# EAGLE design LM502 Break Out Board v1.0 (EAGLE 7.5.0)
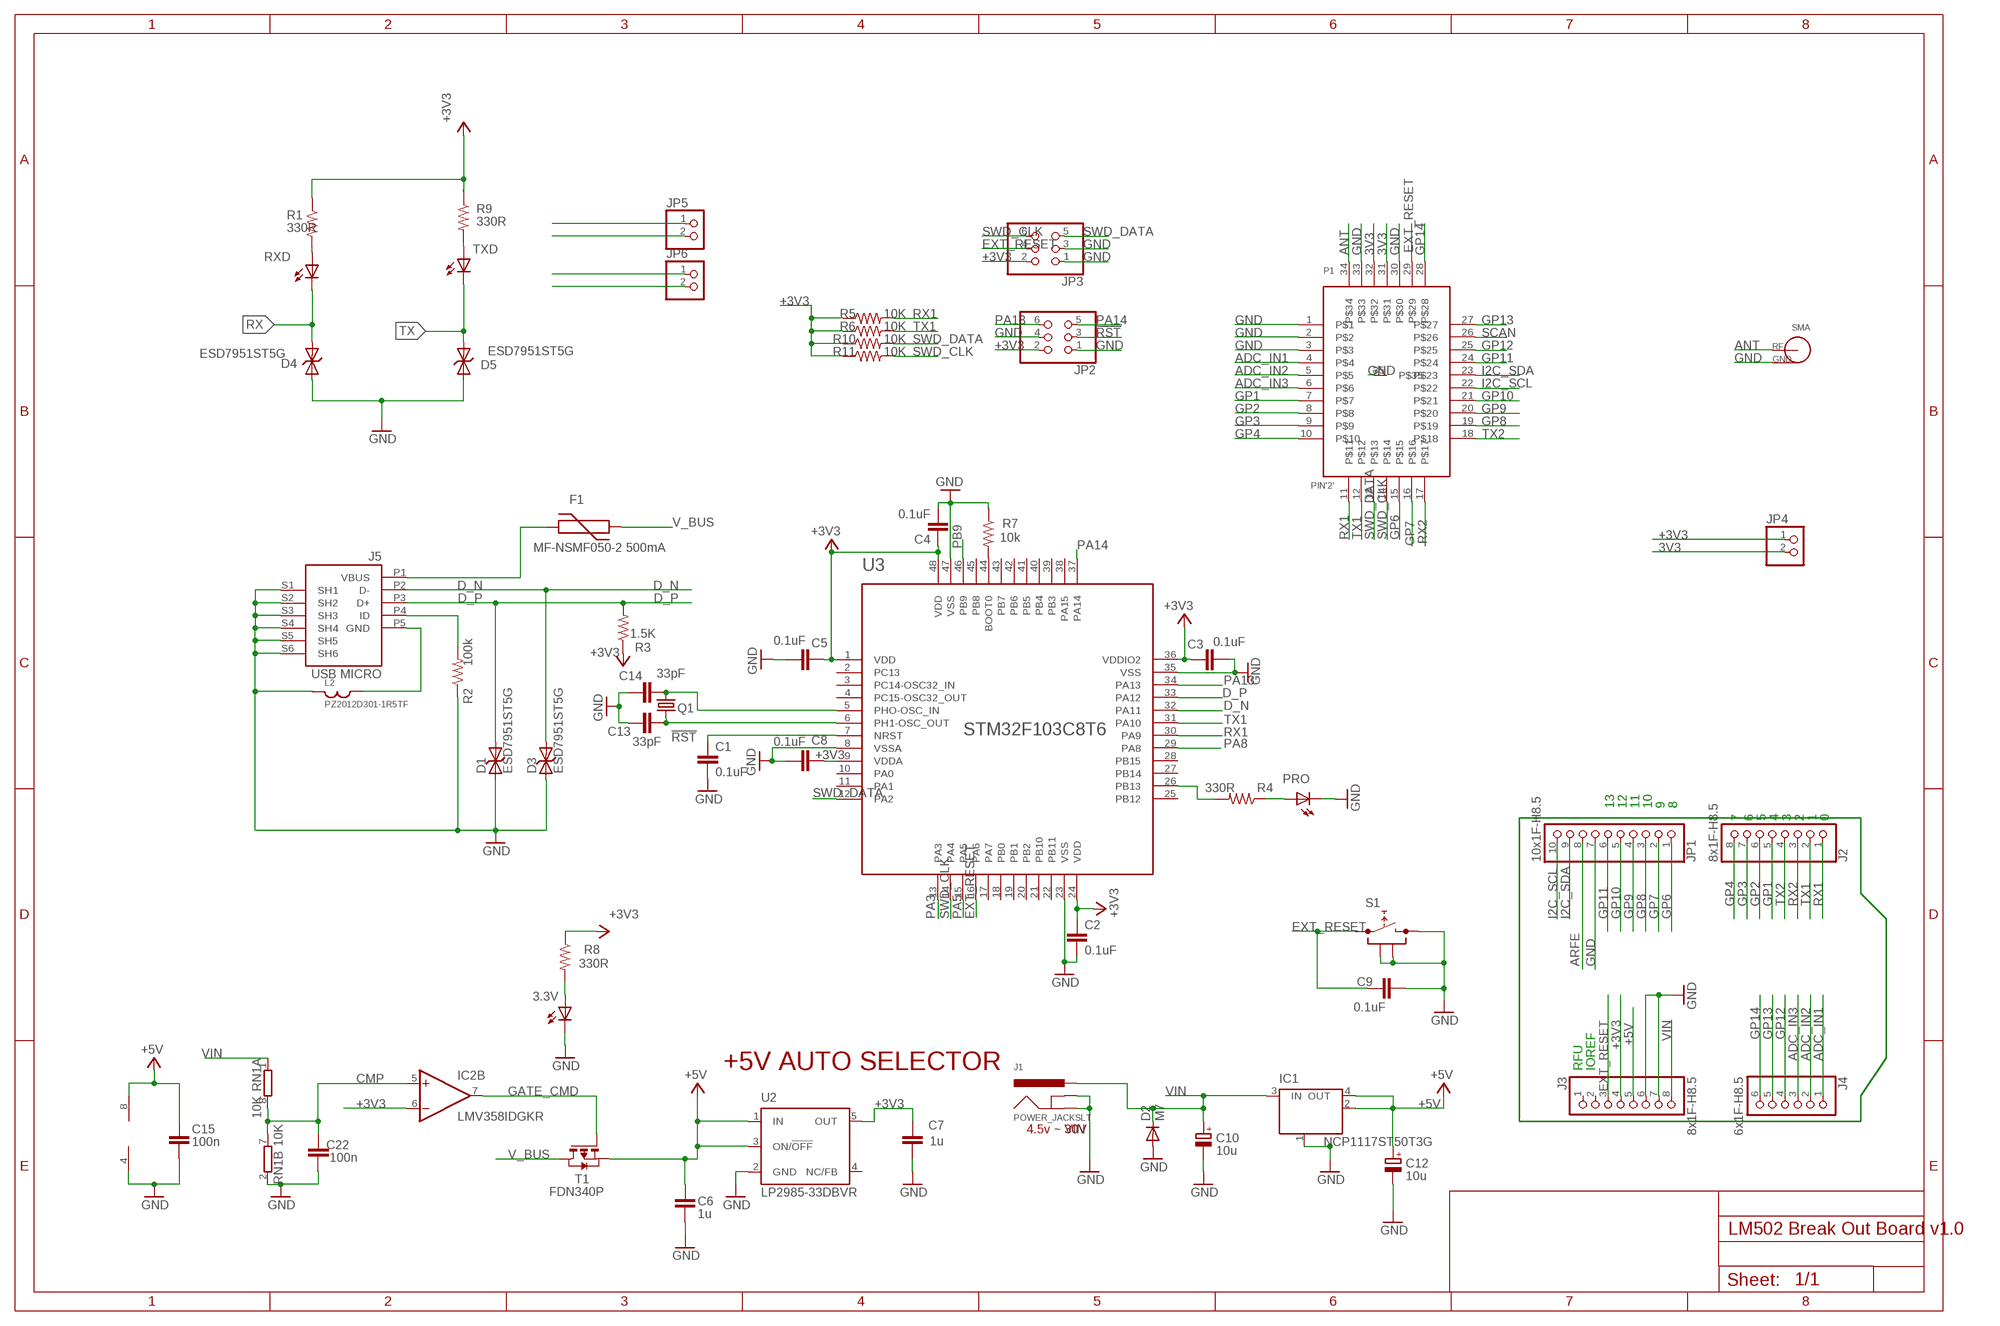
[diagram p0: schematic, sheet 1]

## Parts
3.3V  LEDCHIP-LED0603  [CHIP-LED0603]
C1  0.1uF  C-EUC0402  [C0402]
C2  0.1uF  C-EUC0402  [C0402]
C3  0.1uF  C-EUC0402  [C0402]
C4  0.1uF  C-EUC0402  [C0402]
C5  0.1uF  C-EUC0402  [C0402]
C6  1u  C-EUC0603  [C0603-ROUND]
C7  1u  C-EUC0603  [C0603-ROUND]
C8  0.1uF  C-EUC0402  [C0402]
C9  0.1uF  C-EUC0402  [C0402]
C10  10u  CPOL-EUSMCB  [SMC_B]
C12  10u  CPOL-EUSMCB  [SMC_B]
C13  33pF  C-EUC0402  [C0402]
C14  33pF  C-EUC0402  [C0402]
C15  100n  C-EUC0402  [C0402]
C22  100n  C-EUC0402  [C0402]
D1  ESD7951ST5G  TVSSOD−923  [SOD−923]
D2  M7  DIODE-SMB  [SMB]
D3  ESD7951ST5G  TVSSOD−923  [SOD−923]
D4  ESD7951ST5G  TVSSOD−923  [SOD−923]
D5  ESD7951ST5G  TVSSOD−923  [SOD−923]
F1  MF-NSMF050-2 500mA  FUSE1206  [R1206]
IC1  NCP1117ST50T3G  MC33269ST-3.3T3  [SOT223]
IC2  LMV358IDGKR  LMV358MMX  [MSOP08]
J1  POWER_JACKSLT  [POWER_JACK_SLOT]
J2  8x1F-H8.5  PINHD-1X8  [1X08]
J3  8x1F-H8.5  PINHD-1X8  [1X08]
J4  6x1F-H8.5  PINHD-1X6  [1X06]
J5  USB MICRO  MYCON2_USB-MINI-B  [CON2_USB_MICRO_B_AT]
JP1  10x1F-H8.5  PINHD-1X10  [1X10]
JP2  PINHD-2X3  [2X3-2.0]
JP3  PINHD-2X3'2'  [2X03]
JP4  PINHD-1X2  [1X02]
JP5  PINHD-1X2  [1X02]
JP6  PINHD-1X2  [1X02]
L2  PZ2012D301-1R5TF  BEADS0805  [C0805@1]
P1  PIN'2'  [LM502]
PRO  LEDCHIP-LED0603  [CHIP-LED0603]
Q1  CRYSTALHC49S  [HC49/S]
R1  330R  R-US_R0402  [R0402]
R2  100k  R-US_R0402  [R0402]
R3  1.5K  R-US_R0402  [R0402]
R4  330R  R-US_R0402  [R0402]
R5  10K  R-US_R0402  [R0402]
R6  10K  R-US_R0402  [R0402]
R7  10k  R-US_R0402  [R0402]
R8  330R  R-US_R0402  [R0402]
R9  330R  R-US_R0402  [R0402]
R10  10K  R-US_R0402  [R0402]
R11  10K  R-US_R0402  [R0402]
RN1  10K  4R-NCAY16  [CAY16]
RXD  LEDCHIP-LED0603  [CHIP-LED0603]
S1  PUSH_SWITCH  [SWITCH_6X6X5]
SMA  SMA-KWE  [SMA-KWE]
T1  FDN340P  PMOSSOT23  [SOT-23]
TXD  LEDCHIP-LED0603  [CHIP-LED0603]
U2  LP2985-33DBVR  LP2985-XXDBVR33  [SOT23-DBV]
U3  STM32F103C8T6  STM32L0XX  [LQFP48]

## Nets
3V3: JP4.2 P1.31 P1.32
!RST: C1.1 JP2.3 U3.7(NRST)
+3V3: C2.1 C3.1 C4.1 C5.1 C7.2 C8.1 IC2.6(B:-IN) J3.4 JP2.2 JP3.2 JP4.1 R1.1 R3.1 R5.1 R6.1 R8.1 R9.1 R10.1 R11.1 U2.5(OUT) U3.1(VDD) U3.9(VDDA) U3.24(VDD) U3.36(VDDIO2) U3.48(VDD)
+5V: C6.2 C12.+ C15.1 IC1.2(OUT) IC1.4(OUT) IC2.8(P:V+) J3.5 T1.2(S) U2.1(IN) U2.3(ON/!OFF)
ADC_IN1: J4.1 P1.4
ADC_IN2: J4.2 P1.5
ADC_IN3: J4.3 P1.6
ANT: P1.34 SMA.1(SIG)
ARFE: JP1.8
CMP: C22.2 IC2.5(B:+IN) RN1.7 RN1.8
D_N: D3.P$2 J5.P2(D-) U3.32(PA11)
D_P: D1.P$2 J5.P3(D+) R3.2 U3.33(PA12)
EXT_RESET: C9.1 J3.3 JP3.4 P1.29 S1.1 U3.16(PA6)
GATE_CMD: IC2.7(B:OUT) T1.3(G)
GND [gnd]: 3.3V.C C1.2 C2.2 C3.2 C4.2 C5.2 C6.1 C7.1 C8.2 C9.2 C10.- C12.- C13.1 C14.1 C15.2 C22.1 D1.P$1 D2.A D3.P$1 D4.P$1 D5.P$1 IC1.1(GND/ADJ) IC2.4(P:V-) J1.GND@1(GNDBREAK) J1.GND@2(GND) J3.6 J3.7 J5.S1(SH1) J5.S2(SH2) J5.S3(SH3) J5.S4(SH4) J5.S5(SH5) J5.S6(SH6) JP1.7 JP2.1 JP2.4 JP3.1 JP3.3 L2.1 P1.1 P1.2 P1.3 P1.30 P1.33 P1.35 PRO.C R2.1 R7.1 RN1.2 S1.2 S1.3 S1.4 SMA.2(GND) SMA.3(GND) SMA.4(GND) SMA.5(GND) U2.2(GND) U3.8(VSSA) U3.23(VSS) U3.35(VSS) U3.47(VSS)
GP1: J2.5 P1.7
GP2: J2.6 P1.8
GP3: J2.7 P1.9
GP4: J2.8 P1.10
GP6: JP1.1 P1.15
GP7: JP1.2 P1.16
GP8: JP1.3 P1.19
GP9: JP1.4 P1.20
GP10: JP1.5 P1.21
GP11: JP1.6 P1.24
GP12: J4.4 P1.25
GP13: J4.5 P1.27
GP14: J4.6 P1.28
I2C_SCL: JP1.10 P1.22
I2C_SDA: JP1.9 P1.23
N$1: J5.P4(ID) R2.2
N$2: F1.2 J5.P1(VBUS)
N$3: PRO.A R4.1
N$4: R1.2 RXD.A
N$5: R9.2 TXD.A
N$6: J5.P5(GND) L2.2
N$8: R4.2 U3.26(PB13)
N$9: R7.2 U3.44(BOOT0)
N$12: C13.2 Q1.1 U3.6(PH1-OSC_OUT)
N$14: C14.2 Q1.2 U3.5(PHO-OSC_IN)
N$17: 3.3V.A R8.2
PA3: U3.13(PA3)
PA5: U3.15(PA5)
PA8: U3.29(PA8)
PA13: JP2.6 U3.34(PA13)
PA14: JP2.5 U3.37(PA14)
PB9: U3.46(PB9)
RX: D4.P$2 JP5.1 RXD.C
RX1: J2.1 JP5.2 P1.11 R5.2 U3.30(PA9)
RX2: J2.3 P1.17
SCAN: P1.26
SWD_CLK: JP3.6 P1.14 R11.2 U3.14(PA4)
SWD_DATA: JP3.5 P1.13 R10.2 U3.12(PA2)
TX: D5.P$2 JP6.2 TXD.C
TX1: J2.2 JP6.1 P1.12 R6.2 U3.31(PA10)
TX2: J2.4 P1.18
V_BUS: F1.1 T1.1(D)
VIN: C10.+ D2.C IC1.3(IN) J1.PWR J3.8 RN1.1
Unconnected: IC2.1(A:OUT) IC2.2(A:-IN) IC2.3(A:+IN) J3.1 J3.2 RN1.3 RN1.4 RN1.5 RN1.6 U2.4(NC/FB) U3.2(PC13) U3.3(PC14-OSC32_IN) U3.4(PC15-OSC32_OUT) U3.10(PA0) U3.11(PA1) U3.17(PA7) U3.18(PB0) U3.19(PB1) U3.20(PB2) U3.21(PB10) U3.22(PB11) U3.25(PB12) U3.27(PB14) U3.28(PB15) U3.38(PA15) U3.39(PB3) U3.40(PB4) U3.41(PB5) U3.42(PB6) U3.43(PB7) U3.45(PB8)

## Notes on the sheet
- 13 | 12 | 11 | 10 | 9 | 8
- 7 | 6 | 5 | 4 | 3 | 2 | 1 | 0
- +5V AUTO SELECTOR | RFU | IOREF
- 4.5v ~ 30V

## Library data of the parts
3.3V PRO RXD TXD = led:LED: LED OSRAM: - CHIPLED LG R971, LG N971, LY N971, LG Q971, LY Q971, LO R971, LY R971 LH N974, LH R974 LS Q976, LO Q976, LY Q976 LO Q996 - Hyper CHIPLED LW Q18S LB Q993, LB Q99A, LB R99A - SideLED LS A670, LO A670, LY A670, LG A670, LP A670 LB A673, LV A673, LT A673, LW A673 LH A674 LY A675 LS A676, LA A676, LO A676, LY A676, LW A676 LS A679, LY A679, LG A679 - Hyper Micro SIDELED® LS Y876, LA Y876, LO Y876, LY Y876 LT Y87S - SmartLED LW L88C, LW L88S LB L89C, LB L89S, LG L890 LS L89K, LO L89K, LY L89K LS L896, LA L896, LO L896, LY L896 - TOPLED LS T670, LO T670, LY T670, LG T670, LP T670 LSG T670, LSP T670, LSY T670, LOP T670, LYG T670 LG T671, LOG T671, LSG T671 LB T673, LV T673, LT T673, LW T673 LH T674 LS T676, LA T676, LO T676, LY T676, LB T676, LH T676, LSB T676, LW T676 LB T67C, LV T67C, LT T67C, LS T67K, LO T67K, LY T67K, LW E67C LS E67B, LA E67B, LO E67B, LY E67B, LB E67C, LV E67C, LT E67C LW T67C LS T679, LY T679, LG T679 LS T770, LO T770, LY T770, LG T770, LP T770 LB T773, LV T773, LT T773, LW T773 LH T774 LS E675, LA E675, LY E675, LS T675 LS T776, LA T776, LO T776, LY T776, LB T776 LHGB T686 LT T68C, LB T68C - Hyper Mini TOPLED® LB M676 - Mini TOPLED Santana® LG M470 LS M47K, LO M47K, LY M47K Source: http://www.osram.convergy.de LUXEON: - LUMILED® LXK2-PW12-R00, LXK2-PW12-S00, LXK2-PW14-U00, LXK2-PW14-V00 LXK2-PM12-R00, LXK2-PM12-S00, LXK2-PM14-U00 LXK2-PE12-Q00, LXK2-PE12-R00, LXK2-PE12-S00, LXK2-PE14-T00, LXK2-PE14-U00 LXK2-PB12-K00, LXK2-PB12-L00, LXK2-PB12-M00, LXK2-PB14-N00, LXK2-PB14-P00, LXK2-PB14-Q00 LXK2-PR12-L00, LXK2-PR12-M00, LXK2-PR14-Q00, LXK2-PR14-R00 LXK2-PD12-Q00, LXK2-PD12-R00, LXK2-PD12-S00 LXK2-PH12-R00, LXK2-PH12-S00 LXK2-PL12-P00, LXK2-PL12-Q00, LXK2-PL12-R00 Source: www.luxeon.com KINGBRIGHT: KA-3528ASYC Source: www.kingbright.com
C1-C5 C8 C9 C13 C14 = dragino-passive:C-EU: CAPACITOR, European symbol
C6 C7 C15 C22 = SmartPrj:C-EU: CAPACITOR, European symbol
C10 C12 = rcl:CPOL-EU: POLARIZED CAPACITOR, European symbol
D1 D3-D5 = dragino:TVS: DIODE
D2 = diode:DIODE-: DIODE
F1 = dragino:FUSE: FUSE 5 x 20 mm
IC1 = linear:MC33269ST*: Adjustable Output Low Dropout Voltage Regulator 800 mA Source: http://www.onsemi.com/pub/Collateral/MC33269-D.PDF
IC2 = linear:LMV358?*: Dual General Purpose, Low Voltage, Rail-to-Rail Output Operational Amplifiers Source: http://www.national.com/mpf/LM/LMV321.html http://www.national.com/dt/lmv_qual.pdf
J1 = dragino:POWER_JACK: Power Jack This is the standard 5.5mm barrel jack for power. The PTH is the most common, proven, reliable, footprint. All others are experimental. The Slot footprint only works if the mill layer is transmitted to the PCB fab house so be warned. Spark Fun Electronics SKU : PRT-00119. Mating wall wart : TOL-00298 (and others)
J2 J3 = SmartPrj:PINHD-1X8: PIN HEADER
J4 = SmartPrj:PINHD-1X6: PIN HEADER
J5 = SmartPrj:MYCON2_USB-MINI-B
JP1 = SmartPrj:PINHD-1X10: PIN HEADER
JP2 JP3 = pinhead:PINHD-2X3: PIN HEADER
JP4-JP6 = pinhead:PINHD-1X2: PIN HEADER
L2 = dragino:BEADS
P1 = amis:PIN
Q1 = crystal:CRYSTAL: CRYSTAL; OC_FARNELL: 1667008; OC_NEWARK: unknown
R1-R11 = dragino:R-US_: RESISTOR, American symbol
RN1 = resistor-dil:4R-N: Array Chip Resistor Source: RS Component / Phycomp; OC_FARNELL: unknown; OC_NEWARK: unknown
S1 = dragino:PUSH_SWITCH: PUSH SWITCH ITT-Cannon-Cannon
SMA = dragino:SMA-KWE
T1 = zetex:PMOSSOT23: MOS FET
U2 = SmartPrj:LP2985-XXDBVR: ULTRALOW-POWER 50-mA LOW-DROPOUT LINEAR REGULATORS 50-mA Low-Dropout Regulator Source: http://focus.ti.com/lit/ds/symlink/tps77001.pdf
U3 = dragino:STM32L0XX

## Net classes
1 2layer-50ohm: width 1 mm, clearance 0.2 mm
2 gnd: width 0.305 mm, drill 0.33 mm, clearance 0.254 mm
3 usbvcc: width 0.813 mm, drill 0.61 mm, clearance 0.254 mm
4 aref: width 0.254 mm, drill 0.61 mm, clearance 0.254 mm

## Board
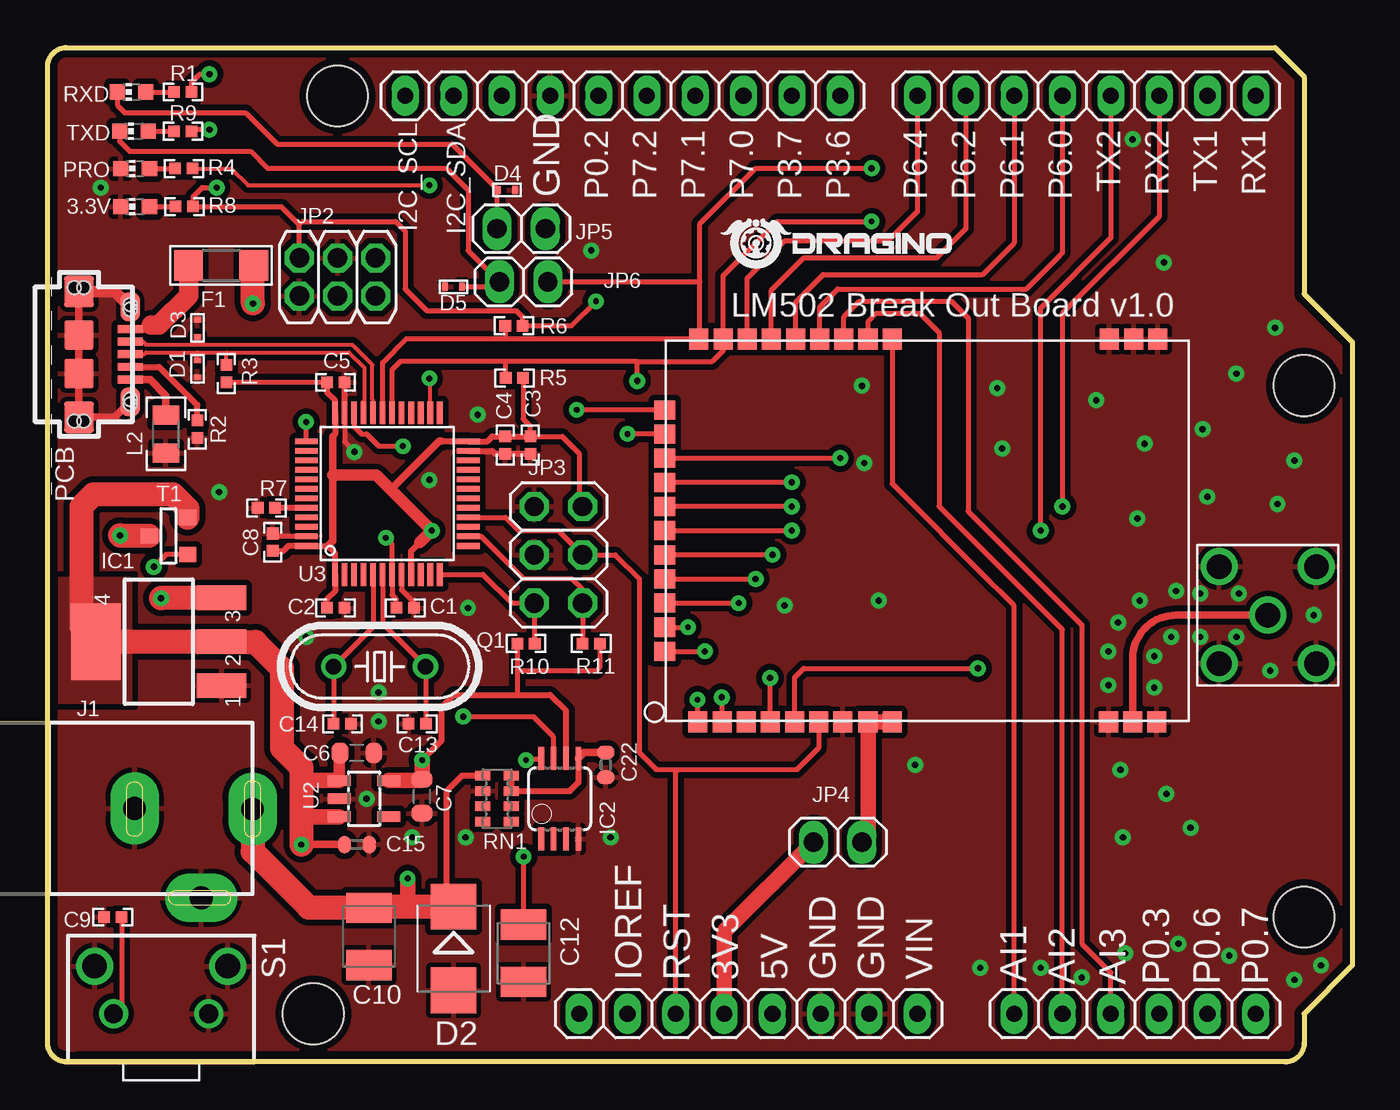
[diagram p1: board, top side]
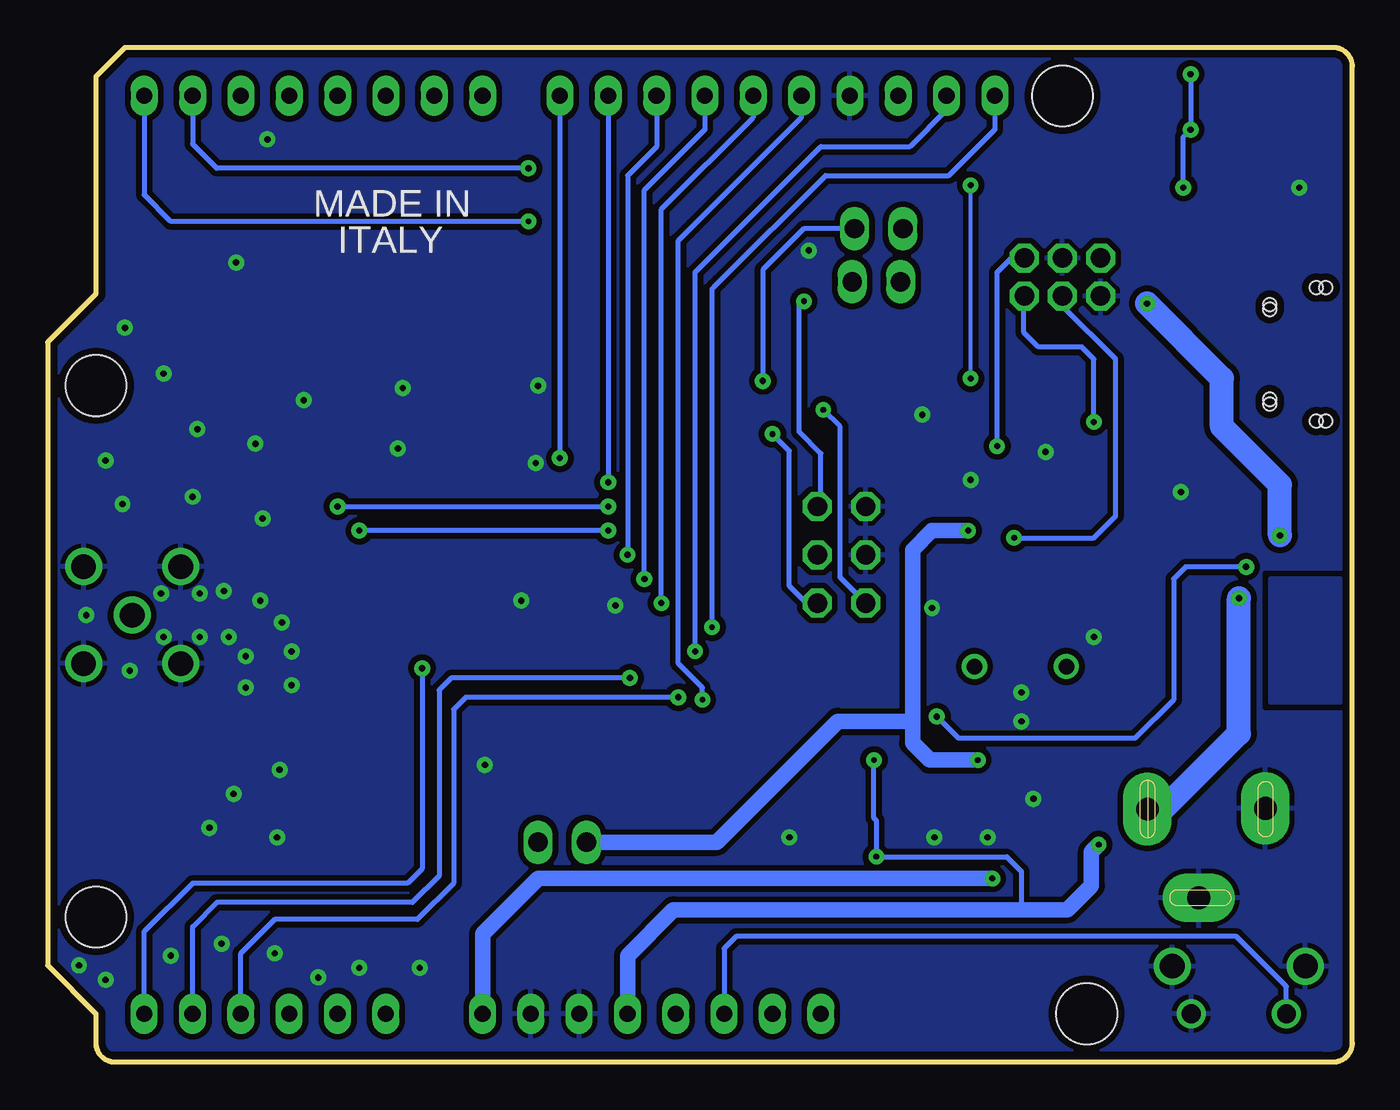
[diagram p2: board, bottom side, seen from below]

Size 68.58 x 53.34 mm. Coordinates in mm from the lower left corner, seen from the top.
Outline: 64.52,53.34 66.04,51.82 66.04,40.39 68.58,37.85 68.58,5.08 66.04,2.54 66.04,1 arc-90 65.04,0 1,0 arc-90 0,1 0,52.34 arc-90 1,53.34 64.52,53.34
Copper layers (1*16): Top 0.035mm / dielectric 1.5mm / Bottom 0.035mm
Design rules "default *": minimum track width 8mil, minimum drill 12mil, track to track 8mil, track to pad 8mil, pad to pad 8mil, via to via 10mil, smd to smd 8mil, copper to edge 15mil, drill to drill 8mil, minimum pad ring 10mil, minimum via ring 10mil, stop-mask expansion 2mil, vias tented up to drill 30mil, thermal gap 10mil
Holes 3.2 mm at 66.04,35.56 66.04,7.62 15.24,50.8 13.97,2.54
vRestrict: area 42.5,38.6 to 43.1,38.9; area 35.8,35.2 to 36.4,35.7; area 44.5,35.2 to 45.2,35.7; area 41.3,35.2 to 41.8,35.7; area 47.9,10.3 to 48.5,10.8; area 50.4,10.2 to 50.9,11

### Footprints (pad centres in the part's own frame; a part is rotated, then mirrored left to right if it is on the bottom)
CHIP-LED0603 = smd 0.8 x 0.8: A 0,-0.75; C 0,0.75
C0402 = smd 0.61 x 0.61: 1 -0.457,0; 2 0.457,0
C0603-ROUND = smd 0.898 x 1.1: 1 -0.889,0; 2 0.889,0
SMC_B = smd 1.6 x 2.4: + -1.5,0; - 1.5,0
C0402' = smd 0.7 x 0.9: 1 -0.65,0; 2 0.65,0
SOD−923 = smd 0.3 x 0.4: P$1 -0.45,0; P$2 0.45,0
SMB = smd 2.4 x 2.4: A 2.2,0; C -2.2,0
R1206 = smd 1.52 x 1.6: 1 -1.71,0; 2 1.71,0
SOT223 = smd 1.3 x 2.6: 1 -2.311,-3.3; 2 0,-3.3; 3 2.311,-3.3 | smd 4 x 2.6: 4 0,3.3
MSOP08 = smd 0.3 x 1.2: 1 -0.976,-2.113; 2 -0.326,-2.113; 3 0.324,-2.113; 4 0.974,-2.113; 5 0.974,2.112; 6 0.324,2.112; 7 -0.326,2.112; 8 -0.976,2.112
POWER_JACK_SLOT = drill 1.2 pad 2.54 long: GND@1 0,0; GND@2 4.7,3.5; PWR 0.04,6.2
1X08 = drill 0.85 pad 1.422 long: 1 -8.89,0; 2 -6.35,0; 3 -3.81,0; 4 -1.27,0; 5 1.27,0; 6 3.81,0; 7 6.35,0; 8 8.89,0
1X06 = drill 0.85 pad 1.422 long: 1 -6.35,0; 2 -3.81,0; 3 -1.27,0; 4 1.27,0; 5 3.81,0; 6 6.35,0
CON2_USB_MICRO_B_AT = smd 0.406 x 1.346: P1 -1.321,2.692; P2 -0.66,2.692; P3 0,2.692; P4 0.66,2.692; P5 1.321,2.692 | smd 1.651 x 1.549: S1 -3.302,0; S2 3.302,0 | smd 1.524 x 1.016: S3 -2.489,2.692; S4 2.489,2.692 | smd 1.524 x 1.524: S5 -1.016,0; S6 1.016,0 | hole 0.7: -3.505,0.254; -3.505,-0.254; 3.505,0.254; 3.505,-0.254; -2.616,2.692; -2.362,2.692; 2.362,2.692; 2.616,2.692
1X10 = drill 0.85 pad 1.422 long: 1 -11.43,0; 2 -8.89,0; 3 -6.35,0; 4 -3.81,0; 5 -1.27,0; 6 1.27,0; 7 3.81,0; 8 6.35,0; 9 8.89,0; 10 11.43,0
2X3-2.0 = drill 1.016 octagon: 1 -2,-1; 2 -2,1; 3 0,-1; 4 0,1; 5 2,-1; 6 2,1
2X03 = drill 1.016 octagon: 1 -2.54,-1.27; 2 -2.54,1.27; 3 0,-1.27; 4 0,1.27; 5 2.54,-1.27; 6 2.54,1.27
1X02 = drill 1.016 long: 1 -1.27,0; 2 1.27,0
C0805@1 = smd 1 x 1.4: 1 -1,0; 2 1,0
LM502 = smd 1 x 1.1: 1 10.09,8.8; 2 8.82,8.8; 3 7.55,8.8; 4 -3.87,8.8; 5 -5.14,8.8; 6 -6.41,8.8; 7 -7.68,8.8; 8 -8.95,8.8; 9 -10.22,8.8; 10 -11.49,8.8; 11 -12.76,8.8; 12 -14.03,8.8; 24 -14.08,-11.34; 25 -12.81,-11.34; 26 -11.54,-11.34; 27 -10.27,-11.34; 28 -9,-11.34; 29 -7.73,-11.34; 30 -6.46,-11.34; 31 -5.14,-11.34; 32 -3.87,-11.34; 33 7.5,-11.34; 34 8.77,-11.34; 35 10.04,-11.34 | smd 1.1 x 1: 13 -15.83,5.08; 14 -15.83,3.81; 15 -15.83,2.54; 16 -15.83,1.27; 17 -15.83,0; 18 -15.83,-1.27; 19 -15.83,-2.54; 20 -15.83,-3.81; 21 -15.83,-5.08; 22 -15.83,-6.35; 23 -15.83,-7.62
HC49/S = drill 0.813: 1 -2.413,0; 2 2.413,0
R0402 = smd 0.61 x 0.61: 1 -0.457,0; 2 0.457,0
CAY16 = smd 0.5 x 0.8: 1 -1.2,-0.75; 2 -0.4,-0.75; 3 0.4,-0.75; 4 1.2,-0.75; 5 1.2,0.75; 6 0.4,0.75; 7 -0.4,0.75; 8 -1.2,0.75
SWITCH_6X6X5 = drill 0.991 pad 1.524: 1 -2.5,0; 2 2.5,0 | drill 1.295 pad 1.905: 3 3.5,2.5; 4 -3.5,2.5
SMA-KWE = drill 1.3: 1 0,0; 2 -2.55,2.55; 3 2.55,2.55; 4 -2.55,-2.55; 5 2.55,-2.55
SOT-23 = smd 0.787 x 0.889: 1 0.025,-1.016; 2 -0.94,1.016; 3 0.991,1.016
SOT23-DBV = smd 0.55 x 1.2: 1 -0.95,-1.3; 2 0,-1.3; 3 0.95,-1.3; 4 0.95,1.3; 5 -0.95,1.3
LQFP48 = smd 1.2 x 0.3: 1 -4.25,2.75; 2 -4.25,2.25; 3 -4.25,1.75; 4 -4.25,1.25; 5 -4.25,0.75; 6 -4.25,0.25; 7 -4.25,-0.25; 8 -4.25,-0.75; 9 -4.25,-1.25; 10 -4.25,-1.75; 11 -4.25,-2.25; 12 -4.25,-2.75; 25 4.25,-2.75; 26 4.25,-2.25; 27 4.25,-1.75; 28 4.25,-1.25; 29 4.25,-0.75; 30 4.25,-0.25; 31 4.25,0.25; 32 4.25,0.75; 33 4.25,1.25; 34 4.25,1.75; 35 4.25,2.25; 36 4.25,2.75 | smd 0.3 x 1.2: 13 -2.75,-4.25; 14 -2.25,-4.25; 15 -1.75,-4.25; 16 -1.25,-4.25; 17 -0.75,-4.25; 18 -0.25,-4.25; 19 0.25,-4.25; 20 0.75,-4.25; 21 1.25,-4.25; 22 1.75,-4.25; 23 2.25,-4.25; 24 2.75,-4.25; 37 2.75,4.25; 38 2.25,4.25; 39 1.75,4.25; 40 1.25,4.25; 41 0.75,4.25; 42 0.25,4.25; 43 -0.25,4.25; 44 -0.75,4.25; 45 -1.25,4.25; 46 -1.75,4.25; 47 -2.25,4.25; 48 -2.75,4.25

### Placement (x,y rotation side)
3.3V  4.6,44.98 90 top
C1  18.8,23.88 0 top
C2  15.14,23.88 0 top
C3  25.37,32.44 270 top
C4  24.05,32.44 270 top
C5  15.14,35.74 0 top
C6  16.26,16.26 180 top
C7  19.68,13.97 90 top
C8  11.84,27.33 90 top
C9  3.43,7.62 180 top
C10  16.89,6.6 270 top
C12  25.02,5.71 270 top
C13  19.43,17.78 0 top
C14  15.49,17.78 180 top
C15  100n  [C0402']  16.26,11.43 0 top
C22  100n  [C0402']  29.34,15.62 90 top
D1  7.87,36.45 90 top
D2  21.34,5.97 270 top
D3  7.87,38.58 270 top
D4  24.13,45.85 180 top
D5  21.34,40.77 0 top
F1  9.12,41.88 180 top
IC1  5.84,22.1 90 top
IC2  26.92,13.84 0 top
J1  4.57,13.34 270 top
J2  54.61,50.8 180 top
J3  36.83,2.54 0 top
J4  57.15,2.54 0 top
J5  1.65,37.21 270 top
JP1  30.23,50.8 180 top
JP2  15.24,41.27 0 top
JP3  26.85,26.67 270 top
JP4  41.53,11.56 0 top
JP5  24.89,43.81 0 top
JP6  25.02,41.02 180 top
L2  6.22,33.02 90 top
P1  48.26,29.21 0 top
PRO  4.6,46.98 90 top
Q1  17.45,20.79 180 top
R1  7.11,51 180 top
R2  7.87,33.27 90 top
R3  9.4,36.2 90 top
R4  7.16,46.98 0 top
R5  24.54,35.97 180 top
R6  24.51,38.71 180 top
R7  11.51,29.13 0 top
R8  7.19,44.98 180 top
R9  7.11,48.94 180 top
R10  25.15,22 0 top
R11  28.57,22 180 top
RN1  23.62,13.84 270 top
RXD  4.41,51 90 top
S1  5.97,2.54 0 top
SMA  64.14,23.5 90 top
T1  6.35,27.69 270 top
TXD  4.54,48.94 90 top
U2  16.64,13.84 270 top
U3  17.86,29.89 90 top
U$7  [LOGO-DRAGINO-2018]  35.39,41.73 0 top

### Tracks (layer width: path | path; a pad name or v marks a point on that pad's centre or on a via)
3V3
  Top 0.813: P1.32 P1.31 43.12,11.88 JP4.2
!RST  (via drill 0.3)
  Top 0.254: C1.1 18.34,24.33 18.11,24.56 U3.7 18.11,27.23 v17.78,27.56
  Bottom 0.254: v17.78,27.56 13.59,27.56 12.45,28.7 12.45,36.96 15.24,39.75 JP2.3
+3V3  (via drill 0.3, 0.33)
  Top 0.254: R5.1 24.99,33.81 25.38,33.43 C3.1 27.05,32.89 27.94,32 27.94,29.39 JP3.2 | JP2.2 13.24,44.04 | 13.24,44.04 12.32,44.96 7.67,44.96 R8.1 7.64,45.49 8.13,45.97 v8.89,45.97 | 13.24,44.04 13.4,44.2 18.29,44.2 18.8,43.69 18.8,40.64 19.94,39.5 24.64,39.5 24.97,39.17 R6.1 27.53,38.71 v28.83,40.01 | R3.1 C5.1 | R11.1 29.03,20.78 28.83,20.57 24.69,20.57 | R1.1 7.57,51.51 8,51.94 v8.51,51.94 | v8.51,49.02 7.65,49.02 R9.1 | R10.1 24.69,20.57 | 24.69,20.57 24.69,19.38 24.77,19.3
  Top 0.305: C5.1 14.68,35.23 15.11,34.8 U3.36 15.11,33.02 14.99,32.89 | C3.1 C4.1 23.37,32.89 23.11,32.64 U3.24 20.7,32.64 | C8.1 12.39,26.87 12.66,27.14 U3.48 14.73,27.14 15.11,26.76 U3.1 15.11,24.76 14.68,24.33 C2.1 | IC2.6 27.25,18.47 26.42,19.3 24.77,19.3 21.34,19.3 20.7,18.67 20.7,16.89 v19.68,15.88 | U3.9 19.11,26.86 19.56,27.3
  Top 0.406: 14.99,32.89 14.99,30.86 14.99,27.39 14.73,27.14 | 20.7,32.64 20.57,32.64 18.03,30.1
  Top 0.61: 19.56,27.3 v20.19,27.94 18.03,30.1 17.27,30.86 14.99,30.86
  Top 0.813: U2.5 19.62,14.79 C7.2 v19.68,15.88 | J3.4 35.56,6.86 JP4.1
  Bottom 0.254: JP3.2 27.94,29.39 27.94,32 29.08,33.15 29.08,39.75 v28.83,40.01 | v8.51,51.94 v8.51,49.02 8.89,48.64 v8.89,45.97
  Bottom 0.813: v19.68,15.88 22.23,15.88 23.11,16.76 23.11,18.03 | JP4.1 33.4,11.56 27.05,17.91 23.24,17.91 23.11,18.03 | v20.19,27.94 22.1,27.94 23.11,26.92 23.11,18.03
+5V  (via drill 0.3)
  Top 0.254: C12.+ v25.02,10.79 | IC2.8 25.91,15.91 25.19,15.91 v25.15,15.88 | 15.34,15.97 15.34,16.23 C6.2
  Top 0.406: C15.1 v13.34,11.43
  Top 0.61: U2.1 15.34,15.97
  Top 0.813: U2.1 13.4,14.79 13.34,14.73 | U2.3 13.4,12.89 13.34,12.95
  Top 1.27: 13.37,11.46 v13.34,11.43 13.34,12.95 13.34,14.73 13.34,15.49 12.32,16.51 12.32,20.7 10.92,22.1 IC1.2 IC1.4 1.78,22.86 1.78,29.21 2.41,29.84 6.6,29.84 7.37,29.08 T1.2
  Bottom 0.254: v25.15,15.88 25.15,12.83 25.02,12.7 v25.02,10.79 18.16,10.79 17.4,10.03 17.4,8.13 17.53,8
  Bottom 0.813: J3.5 38.1,5.59 35.69,8 17.53,8 14.99,8 13.72,9.27 13.72,11.05 v13.34,11.43
  pour Top (no thermals): 0.64,25.4 4.32,25.4 4.32,18.92 0.64,18.92
  pour Bottom (no thermals): 0.64,25.4 4.32,25.4 4.32,18.92 0.64,18.92
ADC_IN1
  Top 0.254: P1.4 44.39,30.41 49.53,25.27 50.04,24.77 50.8,24 J4.1
ADC_IN2
  Top 0.254: P1.5 43.12,38.93 43.56,39.37 45.85,39.37 46.86,38.35 46.86,29.21 51.5,24.57 51.69,24.38 53.34,22.73 J4.2
ADC_IN3
  Top 0.254: P1.6 41.85,39.18 42.67,40.01 47.5,40.01 48.39,39.12 48.39,28.96 54.36,22.99 54.36,6.22 55.88,4.7 J4.3
ANT
  Top 0.406: SMA.1 59.31,23.5 arc90 57.02,21.21 P1.34 arc90 P1.34
CMP
  Top 0.305: RN1.8 RN1.7 27.45,14.24 27.9,14.69 IC2.5
  Top 0.406: C22.2 28.21,16.27 IC2.5
D_N
  Top 0.203: J5.P2 5.03,37.87 5.18,37.72 7.87,37.72 | U3.32 17.11,34.78 17.07,34.82 17.07,36.66 16.01,37.72 7.87,37.72 | D3.P$2 7.87,37.72
D_P
  Top 0.203: J5.P3 5.08,37.21 5.18,37.31 7.87,37.31 | U3.33 16.61,34.77 16.66,34.82 16.66,36.49 15.84,37.31 9.4,37.31 | 7.87,37.31 9.4,37.31 | D1.P$2 7.87,37.31 | R3.2 9.4,37.31
EXT_RESET
  Top 0.254: U3.16 24.07,28.64 24.77,27.94 26.85,27.94 JP3.4 29.84,26.67 31.11,25.4 31.11,16.26 32,15.37 33.15,15.37 | P1.29 40.53,16.51 39.39,15.37 33.15,15.37 | J3.3 33.02,15.24 33.15,15.37 | C9.1 3.89,2.96 S1.1
  Bottom 0.254: S1.1 3.47,3.98 6.1,6.6 32.38,6.6 33.02,5.97 J3.3
GATE_CMD  (via drill 0.33)
  Top 0.254: T1.3 6.25,26.7 v5.59,26.04 | v21.84,18.16 25.53,18.16 26.6,17.09 IC2.7
  Bottom 0.254: v5.59,26.04 8.76,26.04 9.4,25.4 9.4,19.05 11.43,17.02 20.7,17.02 v21.84,18.16
GND  (via drill 0.33)
  Top 0.254: U3.47 11.99,27.64 C8.2 | U3.35 15.61,32.6 v16.13,32.08 | U3.8 18.61,24.82 19.25,24.18 C1.2
  Top 0.305: U3.35 15.61,35.73 C5.2 | U3.23 23.36,32.14 23.52,31.98 C4.2 C3.2
  Top 0.406: J5.S4 3.53,33.91 J5.S2 J5.S6 J5.S5 J5.S1
  Top 0.61: J5.S1 3.53,40.51 J5.S3
  other vias: 20.07,30.61 22.1,23.88 9.02,29.97 55.75,19.81 55.75,21.59 56.26,23.11 57.4,24.26 59.31,24.77 62.61,24.64 60.58,24.64 62.48,22.35 60.58,22.35 59.05,22.35 58.17,21.34 58.17,19.68 38.73,24 43.69,24.26 17.4,19.43 17.4,17.91 42.93,31.5 42.8,35.56 49.91,35.43 50.16,32.26 57.66,32.51 57.28,28.57 55.12,34.8 60.71,33.27 64.64,29.34 62.48,36.2 64.52,38.61 60.96,29.72 65.53,31.62 56.39,15.37 56.52,11.81 60.07,12.32 64.26,20.57 66.55,23.5 58.8,14.1 45.59,15.62 49.02,4.95 52.2,4.95 54.36,4.45 56.64,5.71 59.44,6.22 62.1,5.59 65.53,4.32 66.93,5.08 58.67,42.04 57.02,48.51 2.79,45.97 13.59,22.35 29.59,11.81 19.18,11.81 21.97,11.81 16.76,13.84 22.61,34.04 28.57,42.67
  pour Bottom (isolate 0.305, rank 2): 0,54.23 71.12,54.23 71.12,0.64 1.64,0.64 arc-90 0,1.64
  pour Top (isolate 0.305, rank 2): 0,54.23 71.12,54.23 71.12,1.64 arc-90 70.12,0.64 1.64,0.64 arc-90 0,1.64
GP1
  Top 0.254: P1.7 40.58,39.69 41.53,40.64 51.44,40.64 52.96,42.16 53.21,42.42 53.34,42.55 J2.5
GP2
  Top 0.254: P1.8 39.31,39.95 40.77,41.4 49.15,41.4 50.8,43.05 J2.6
GP3
  Top 0.254: P1.9 38.04,40.58 39.75,42.29 46.74,42.29 48.26,43.81 J2.7
GP4
  Top 0.254: P1.10 36.77,41.22 38.73,43.18 44.2,43.18 45.72,44.7 J2.8
GP6  (via drill 0.33)
  Top 0.254: P1.15 v41.66,31.75
  Bottom 0.254: JP1.1 v41.66,31.75
GP7  (via drill 0.33)
  Top 0.254: v39.12,30.48 P1.16
  Bottom 0.254: JP1.2 v39.12,30.48
GP8  (via drill 0.33)
  Top 0.254: v38.1,26.67 P1.19
  Bottom 0.254: JP1.3 36.58,48.13 38.1,46.61 v38.1,26.67
GP9  (via drill 0.33)
  Top 0.254: P1.20 v37.21,25.4
  Bottom 0.254: JP1.4 34.04,49.02 37.21,45.85 v37.21,25.4
GP10  (via drill 0.3)
  Top 0.254: P1.21 v36.32,24.13
  Bottom 0.254: JP1.5 31.5,49.66 36.32,44.83 v36.32,24.13
GP11  (via drill 0.3)
  Top 0.254: P1.24 34.18,19.03 v34.16,19.05
  Bottom 0.254: v34.16,19.05 34.16,19.68 35.43,20.95 35.43,43.18 34.92,43.69 34.67,43.94 28.96,49.66 JP1.6
GP12  (via drill 0.33)
  Top 0.254: P1.25 35.45,19.16 v35.43,19.18
  Bottom 0.254: v35.43,19.18 46.61,19.18 47.24,18.54 47.24,9.4 49.15,7.49 56.64,7.49 58.42,5.71 J4.4
GP13  (via drill 0.33)
  Top 0.254: P1.27 37.99,20.18 v37.97,20.19
  Bottom 0.254: v37.97,20.19 47.37,20.19 48.01,19.56 48.01,9.78 49.4,8.38 59.69,8.38 60.96,7.11 J4.5
GP14  (via drill 0.33)
  Top 0.254: P1.28 39.26,20.21 39.75,20.7 v48.9,20.7
  Bottom 0.254: v48.9,20.7 48.9,10.16 49.66,9.4 60.96,9.4 63.5,6.86 J4.6
I2C_SCL  (via drill 0.3)
  Top 0.254: P1.22 v33.66,22.86
  Bottom 0.254: JP1.10 18.8,49.02 21.21,46.61 27.69,46.61 33.27,41.02 33.53,40.77 33.66,40.64 v33.66,22.86
I2C_SDA  (via drill 0.3)
  Top 0.254: P1.23 v34.54,21.59
  Bottom 0.254: JP1.9 21.34,50.04 23.24,48.13 27.94,48.13 33.78,42.29 34.16,41.91 34.54,41.53 v34.54,21.59
N$1
  Top 0.305: J5.P4 5.87,36.55 7.87,34.54 R2.2
N$2
  Top 0.406: J5.P1 5.26,38.53 5.46,38.73
  Top 1.016: 5.46,38.73 5.84,38.73 7.41,40.3 F1.2
N$3
  Top 0.254: PRO.A R4.1
N$4
  Top 0.254: RXD.A R1.2
N$5
  Top 0.254: TXD.A R9.2
N$6
  Top 0.406: J5.P5 5.38,35.89 6.22,35.05 L2.2
N$8  (via drill 0.3)
  Top 0.203: R4.2 9.66,46.98 10.54,46.1 v20.07,46.1 | U3.26 20.11,35.9 v20.07,35.94
  Bottom 0.203: v20.07,35.94 v20.07,46.1
N$9
  Top 0.305: U3.44 R7.2
N$12
  Top 0.254: U3.6 17.61,23.05 Q1.1 19.86,17.8 C13.2
N$14
  Top 0.254: U3.5 17.11,22.86 Q1.2 C14.2
N$17
  Top 0.254: 3.3V.A R8.2
PA13  (via drill 0.3)
  Top 0.254: U3.34 16.11,33.42 16.51,33.02 16.76,33.02 17.4,32.38 v18.67,32.38
  Bottom 0.254: v18.67,32.38 18.67,41.53 17.92,42.27 JP2.6
PA14  (via drill 0.3)
  Top 0.254: U3.37 13.61,33.63 v13.59,33.66
  Bottom 0.254: v13.59,33.66 13.59,36.96 14.22,37.59 16.51,37.59 17.27,38.35 17.27,40.24 JP2.5
RX
  Top 0.254: JP5.1 23.62,45.79 D4.P$2 21.27,48.26 12.06,48.26 10.41,49.91 4.06,49.91 3.66,50.31 RXD.C
RX1  (via drill 0.3, 0.33)
  Top 0.254: v43.31,44.2 38.35,44.2 35.5,41.34 P1.11 35.5,37.41 34.92,36.83 30.99,36.83 | U3.30 18.11,36.4 18.54,36.83 24,36.83 | v30.99,35.81 30.99,36.83 | 30.99,36.83 24,36.83 | R5.2 24.08,36.75 24,36.83
  Bottom 0.254: v43.31,44.2 62.1,44.2 63.5,45.59 J2.1 | JP5.2 28.83,43.81 30.99,41.66 v30.99,35.81
RX2  (via drill 0.33)
  Top 0.254: J2.3 58.42,44.45 53.34,39.37 v53.34,29.21 | v39.12,29.21 P1.17
  Bottom 0.254: v53.34,29.21 v39.12,29.21
SWD_CLK  (via drill 0.3)
  Top 0.254: R11.2 JP3.6 28.12,24.84 27.56,25.4 25.02,25.4 22.78,27.64 U3.14 | P1.14 v30.48,33.02
  Bottom 0.254: JP3.6 28.7,24.13 29.59,25.02 29.59,32.13 v30.48,33.02
SWD_DATA  (via drill 0.3)
  Top 0.254: R10.2 25.6,24.11 JP3.5 24.38,24.13 22.88,25.64 U3.12 | P1.13 v27.81,34.29
  Bottom 0.254: JP3.5 26.92,25.48 26.92,33.4 v27.81,34.29
TX
  Top 0.254: TXD.C 3.79,48.41 4.32,47.88 10.67,47.88 11.56,46.99 20.95,46.99 22.1,45.85 22.1,42.67 JP6.2 23.5,40.77 D5.P$2
TX1  (via drill 0.33)
  Top 0.254: 34.29,41.02 34.29,38.07 P1.12 24,38.01 | 24,38.01 18.83,38.01 17.61,36.79 U3.31 | R6.2 24.05,38.06 24,38.01 | JP6.1 34.29,41.02 | 34.29,41.02 34.29,44.07 37.21,46.99 v43.31,46.99
  Bottom 0.254: v43.31,46.99 59.69,46.99 60.96,48.26 J2.2
TX2  (via drill 0.33)
  Top 0.254: J2.4 55.88,43.33 52.2,39.65 v52.2,27.94 | P1.18 v39.12,27.94
  Bottom 0.254: v39.12,27.94 v52.2,27.94
V_BUS  (via drill 0.33)
  Top 1.27: T1.1 3.83,27.66 v3.81,27.69 | v10.79,39.88 10.79,41.85 F1.1
  Bottom 1.27: v3.81,27.69 3.81,30.35 6.86,33.4 6.86,35.94 v10.79,39.88
VIN  (via drill 0.3, 0.33)
  Top 0.305: 20.83,8.17 20.95,8.3 20.95,14.22 21.77,15.04 RN1.1
  Top 0.813: v18.92,9.65 18.92,8.17
  Top 1.27: D2.C 20.83,8.17 18.92,8.17 16.96,8.17 C10.+ 16.87,8.13 13.72,8.13 10.77,11.07 J1.PWR | IC1.3 5.99,24.41 v5.97,24.38
  Bottom 0.813: J3.8 45.72,6.73 42.8,9.65 v18.92,9.65
  Bottom 1.27: J1.PWR 9.95,13.29 5.97,17.27 v5.97,24.38

### Text on the board
tPlace: I2C_SCL | I2C_SDA | P0.2 | P7.2 | P7.1 | P7.0 | P3.7 | P3.6 | P6.4 | P6.2 | P6.1 | P6.0 | TX2 | RX2 | TX1 | RX1 | LM502 Break Out Board v1.0
tNames: GND | IOREF | RST | 3V3 | 5V | GND | GND | VIN | AI1 | AI2 | AI3 | P0.3 | P0.6 | P0.7
bNames: MADE IN | ITALY